# Altium project CryptUS_Daughterboard_Rev1_A.PrjPcb (part 2 of 2)

## Sheet DDR3 Termination.SchDoc
size A4; SheetNumber: 11; SheetTotal: 12
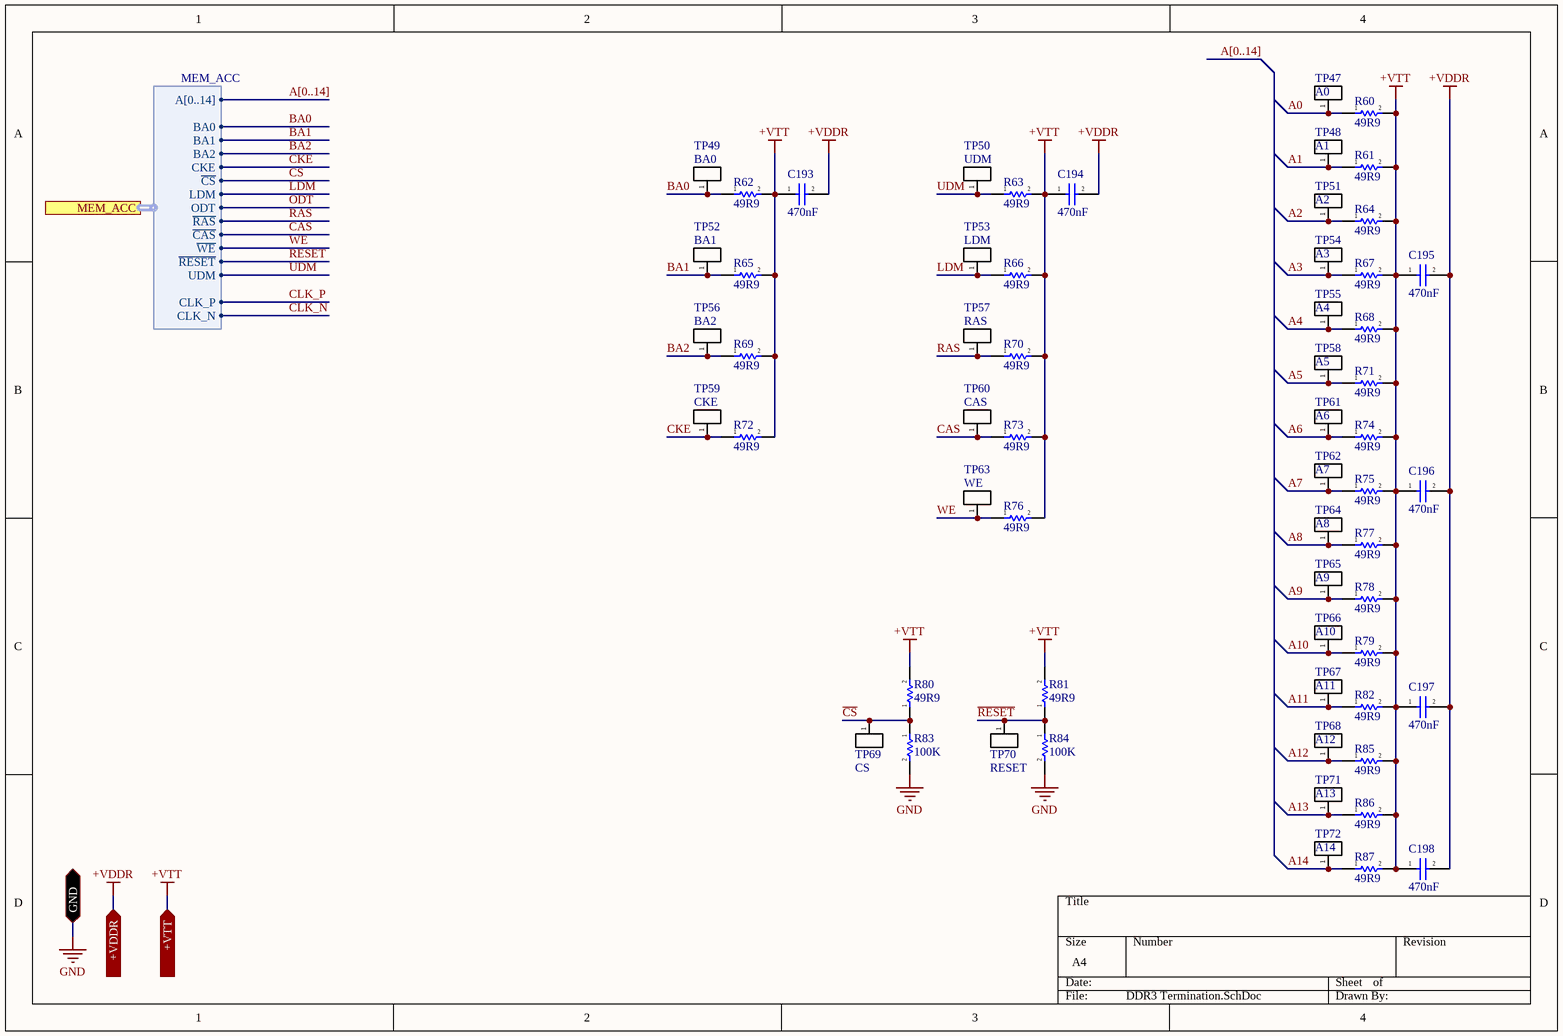
[diagram p10: DDR3 Termination.SchDoc]

### Parts
C193  470nF  [CAP_0402]
C194  470nF  [CAP_0402]
C195  470nF  [CAP_0402]
C196  470nF  [CAP_0402]
C197  470nF  [CAP_0402]
C198  470nF  [CAP_0402]
R60  49R9  [RES_0402]
R61  49R9  [RES_0402]
R62  49R9  [RES_0402]
R63  49R9  [RES_0402]
R64  49R9  [RES_0402]
R65  49R9  [RES_0402]
R66  49R9  [RES_0402]
R67  49R9  [RES_0402]
R68  49R9  [RES_0402]
R69  49R9  [RES_0402]
R70  49R9  [RES_0402]
R71  49R9  [RES_0402]
R72  49R9  [RES_0402]
R73  49R9  [RES_0402]
R74  49R9  [RES_0402]
R75  49R9  [RES_0402]
R76  49R9  [RES_0402]
R77  49R9  [RES_0402]
R78  49R9  [RES_0402]
R79  49R9  [RES_0402]
R80  49R9  [RES_0402]
R81  49R9  [RES_0402]
R82  49R9  [RES_0402]
R83  100K  [RES_0603]
R84  100K  [RES_0603]
R85  49R9  [RES_0402]
R86  49R9  [RES_0402]
R87  49R9  [RES_0402]
TP47  A0  [TP_PAD_TINY]  (no BOM)
TP48  A1  [TP_PAD_TINY]  (no BOM)
TP49  BA0  [TP_PAD_TINY]  (no BOM)
TP50  UDM  [TP_PAD_TINY]  (no BOM)
TP51  A2  [TP_PAD_TINY]  (no BOM)
TP52  BA1  [TP_PAD_TINY]  (no BOM)
TP53  LDM  [TP_PAD_TINY]  (no BOM)
TP54  A3  [TP_PAD_TINY]  (no BOM)
TP55  A4  [TP_PAD_TINY]  (no BOM)
TP56  BA2  [TP_PAD_TINY]  (no BOM)
TP57  RAS  [TP_PAD_TINY]  (no BOM)
TP58  A5  [TP_PAD_TINY]  (no BOM)
TP59  CKE  [TP_PAD_TINY]  (no BOM)
TP60  CAS  [TP_PAD_TINY]  (no BOM)
TP61  A6  [TP_PAD_TINY]  (no BOM)
TP62  A7  [TP_PAD_TINY]  (no BOM)
TP63  WE  [TP_PAD_TINY]  (no BOM)
TP64  A8  [TP_PAD_TINY]  (no BOM)
TP65  A9  [TP_PAD_TINY]  (no BOM)
TP66  A10  [TP_PAD_TINY]  (no BOM)
TP67  A11  [TP_PAD_TINY]  (no BOM)
TP68  A12  [TP_PAD_TINY]  (no BOM)
TP69  CS  [TP_PAD_TINY]  (no BOM)
TP70  RESET  [TP_PAD_TINY]  (no BOM)
TP71  A13  [TP_PAD_TINY]  (no BOM)
TP72  A14  [TP_PAD_TINY]  (no BOM)

### Ports
+VDDR (in), +VTT (in), GND (bidir), MEM_ACC (harness MEM_ACC)

### Harnesses
MEM_ACC: A[0..14], BA0, BA1, BA2, CKE, ~{CS}, LDM, ODT, ~{RAS}, ~{CAS}, ~{WE}, ~{RESET}, UDM, CLK_N, CLK_P

### Nets
+VDDR: C193.2 C194.2 C195.2 C196.2 C197.2 C198.2 ; port +VDDR
+VTT: C193.1 C194.1 C195.1 C196.1 C197.1 C198.1 R60.2 R61.2 R62.2 R63.2 R64.2 R65.2 R66.2 R67.2 R68.2 R69.2 R70.2 R71.2 R72.2 R73.2 R74.2 R75.2 R76.2 R77.2 R78.2 R79.2 R80.2 R81.2 R82.2 R85.2 R86.2 R87.2 ; port +VTT
GND: R83.2 R84.2 ; port GND
~{CS}: R80.1 R83.1 TP69.1(A) ; port MEM_ACC.~{CS}
~{RESET}: R81.1 R84.1 TP70.1(A) ; port MEM_ACC.~{RESET}
A0: R60.1 TP47.1(A)
A1: R61.1 TP48.1(A)
A2: R64.1 TP51.1(A)
A3: R67.1 TP54.1(A)
A4: R68.1 TP55.1(A)
A5: R71.1 TP58.1(A)
A6: R74.1 TP61.1(A)
A7: R75.1 TP62.1(A)
A8: R77.1 TP64.1(A)
A9: R78.1 TP65.1(A)
A10: R79.1 TP66.1(A)
A11: R82.1 TP67.1(A)
A12: R85.1 TP68.1(A)
A13: R86.1 TP71.1(A)
A14: R87.1 TP72.1(A)
BA0: R62.1 TP49.1(A) ; port MEM_ACC.BA0
BA1: R65.1 TP52.1(A) ; port MEM_ACC.BA1
BA2: R69.1 TP56.1(A) ; port MEM_ACC.BA2
CAS: R73.1 TP60.1(A)
CKE: R72.1 TP59.1(A) ; port MEM_ACC.CKE
LDM: R66.1 TP53.1(A) ; port MEM_ACC.LDM
RAS: R70.1 TP57.1(A)
UDM: R63.1 TP50.1(A) ; port MEM_ACC.UDM
WE: R76.1 TP63.1(A)

### Buses and harness runs
bus A[0..14]

### Library data of the parts
C193-C198 = CAP_CER: as CX2 on sheet Title; Operating Temperature: *; Tolerance: *; Mfr: *; ComponentLink1Description: Digikey; ComponentLink1URL: [Digikey Link]; Digikey Part No: *; ComponentLink2Description: Datasheet; ComponentLink2URL: [Datasheet Link]; Footprint: 0402
R60-R82 R85-R87 = RESISTOR: Power: 1/8W; Tolerance: 0.5%; Automotive: *; Operating Temperature: *; Package / Case: 0402; # Digikey: *; ComponentLink1Description: Digikey; ComponentLink1URL: *; # Manufacturer: *
R83 R84 = RESISTOR: Power: 1/16W; Tolerance: 10%; Automotive: *; Operating Temperature: *; # Digikey: *; ComponentLink1Description: Digikey; ComponentLink1URL: *; # Manufacturer: *; Package / Case: 0603
TP47-TP72 = TESTPOINT: Test Point

## Sheet USB.SchDoc
size A3; SheetNumber: 12; SheetTotal: 12
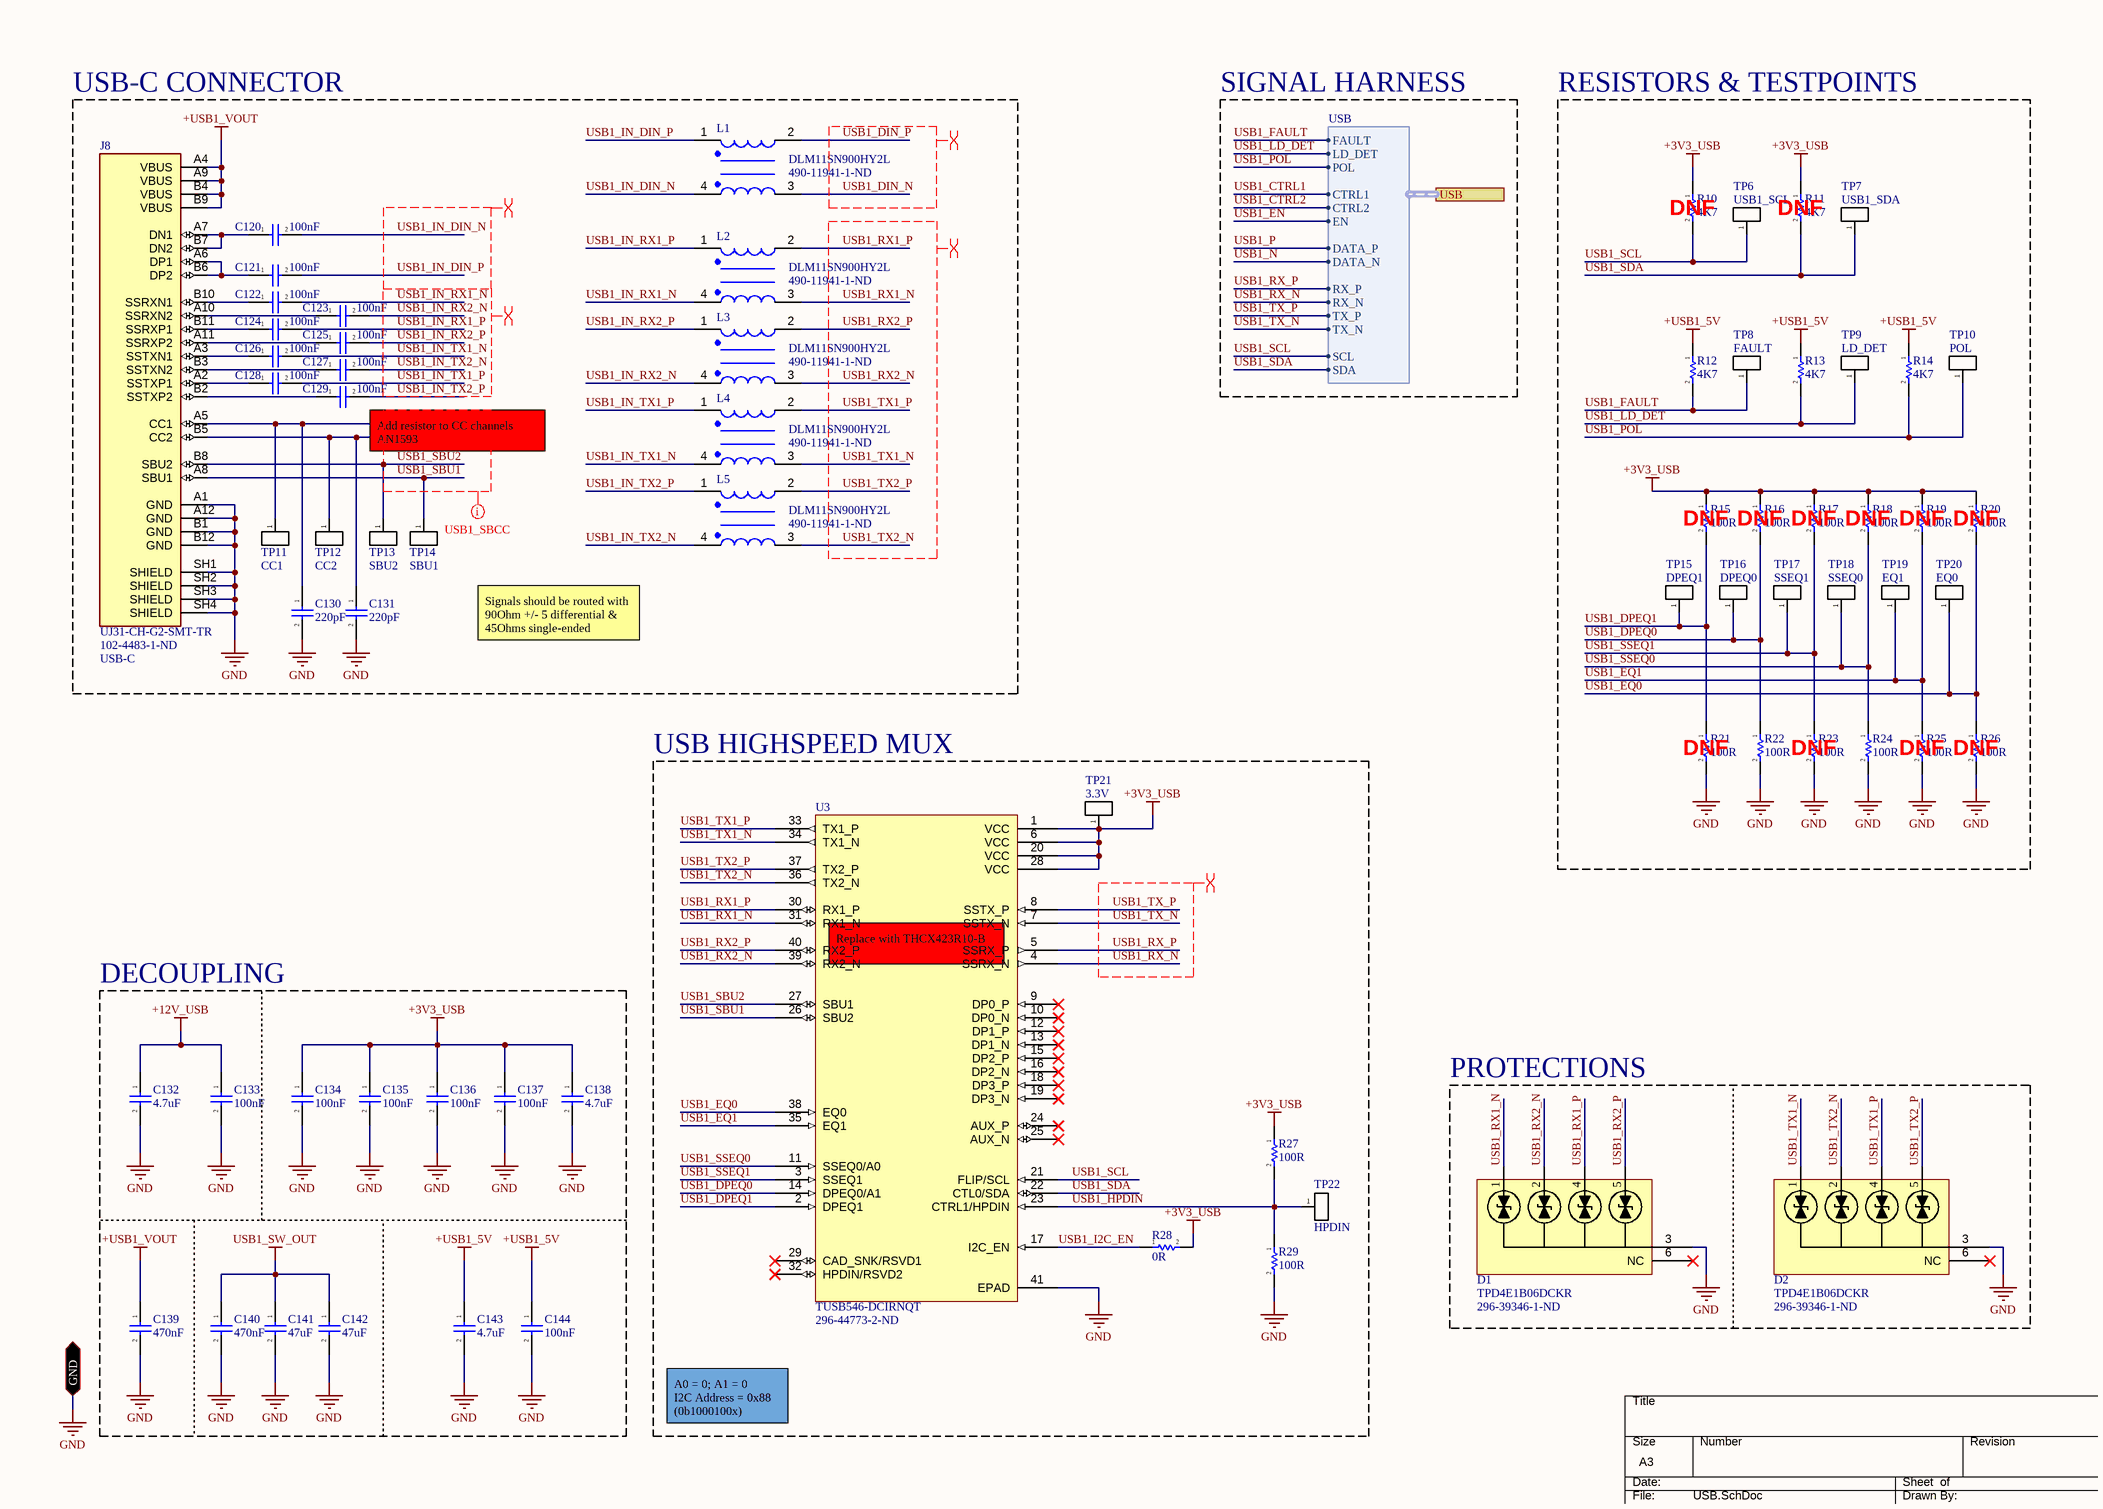
[diagram p11: USB.SchDoc]

### Parts
C120  100nF  [CAP_0402]
C121  100nF  [CAP_0402]
C122  100nF  [CAP_0402]
C123  100nF  [CAP_0402]
C124  100nF  [CAP_0402]
C125  100nF  [CAP_0402]
C126  100nF  [CAP_0402]
C127  100nF  [CAP_0402]
C128  100nF  [CAP_0402]
C129  100nF  [CAP_0402]
C130  220pF  [CAP_0402]
C131  220pF  [CAP_0402]
C132  4.7uF  [CAP_0805]
C133  100nF  [CAP_0402]
C134  100nF  [CAP_0402]
C135  100nF  [CAP_0402]
C136  100nF  [CAP_0402]
C137  100nF  [CAP_0402]
C138  4.7uF  [CAP_0805]
C139  470nF  [CAP_0402]
C140  470nF  [CAP_0402]
C141  47uF  [CAP_1206]
C142  47uF  [CAP_1206]
C143  4.7uF  [CAP_0805]
C144  100nF  [CAP_0402]
D1  TPD4E1B06DCKR  Supplier Part Number 1: 296-39346-1-ND  [TPD4E1B06DCKR]
D2  TPD4E1B06DCKR  Supplier Part Number 1: 296-39346-1-ND  [TPD4E1B06DCKR]
J8  UJ31-CH-G2-SMT-TR  Connector Type: USB-C  Supplier Part Number 1: 102-4483-1-ND  [UJ31-CH-G2-SMT-TR]
L1  DLM11SN900HY2L  Supplier Part Number 1: 490-11941-1-ND  [DLM11SN900HY2L]
L2  DLM11SN900HY2L  Supplier Part Number 1: 490-11941-1-ND  [DLM11SN900HY2L]
L3  DLM11SN900HY2L  Supplier Part Number 1: 490-11941-1-ND  [DLM11SN900HY2L]
L4  DLM11SN900HY2L  Supplier Part Number 1: 490-11941-1-ND  [DLM11SN900HY2L]
L5  DLM11SN900HY2L  Supplier Part Number 1: 490-11941-1-ND  [DLM11SN900HY2L]
R10  4K7  [RES_0603]
R11  4K7  [RES_0603]
R12  4K7  [RES_0603]
R13  4K7  [RES_0603]
R14  4K7  [RES_0603]
R15  100R  [RES_0402]
R16  100R  [RES_0402]
R17  100R  [RES_0402]
R18  100R  [RES_0402]
R19  100R  [RES_0402]
R20  100R  [RES_0402]
R21  100R  [RES_0402]
R22  100R  [RES_0402]
R23  100R  [RES_0402]
R24  100R  [RES_0402]
R25  100R  [RES_0402]
R26  100R  [RES_0402]
R27  100R  [RES_0402]
R28  0R  [RES_0603]
R29  100R  [RES_0402]
TP6  USB1_SCL  [TP_PAD_SMALL]  (no BOM)
TP7  USB1_SDA  [TP_PAD_SMALL]  (no BOM)
TP8  FAULT  [TP_PAD_TINY]  (no BOM)
TP9  LD_DET  [TP_PAD_TINY]  (no BOM)
TP10  POL  [TP_PAD_TINY]  (no BOM)
TP11  CC1  [TP_PAD_TINY]  (no BOM)
TP12  CC2  [TP_PAD_TINY]  (no BOM)
TP13  SBU2  [TP_PAD_TINY]  (no BOM)
TP14  SBU1  [TP_PAD_TINY]  (no BOM)
TP15  DPEQ1  [TP_PAD_TINY]  (no BOM)
TP16  DPEQ0  [TP_PAD_TINY]  (no BOM)
TP17  SSEQ1  [TP_PAD_TINY]  (no BOM)
TP18  SSEQ0  [TP_PAD_TINY]  (no BOM)
TP19  EQ1  [TP_PAD_TINY]  (no BOM)
TP20  EQ0  [TP_PAD_TINY]  (no BOM)
TP21  3.3V  [TP_PAD]  (no BOM)
TP22  HPDIN  [TP_PAD_TINY]  (no BOM)
U3  TUSB546-DCIRNQT  Supplier Part Number 1: 296-44773-2-ND  [TUSB546-DCIRNQT]

### Blocks framed on the sheet
USB-C CONNECTOR: C120-C131 J8 L1-L5 TP11-TP14
RESISTORS & TESTPOINTS: R10-R26 TP6-TP10 TP15-TP20
USB HIGHSPEED MUX: R27-R29 TP21 TP22 U3
DECOUPLING: C132-C144
PROTECTIONS: D1 D2

### Ports
GND (bidir), USB (harness USB)

### Harnesses
USB: FAULT, LD_DET, POL, CTRL1, CTRL2, EN, DATA_P, DATA_N, RX_P, RX_N, TX_P, TX_N, SCL, SDA

### Nets
+3V3_USB: C134.1 C135.1 C136.1 C137.1 C138.1 R10.1 R11.1 R15.1 R16.1 R17.1 R18.1 R19.1 R20.1 R27.1 R28.2 TP21.1(A) U3.1(VCC) U3.6(VCC) U3.20(VCC) U3.28(VCC)
+12V_USB: C132.1 C133.1
+USB1_5V: C143.1 C144.1 R12.1 R13.1 R14.1
+USB1_VOUT: C139.1 J8.A4(VBUS) J8.A9(VBUS) J8.B4(VBUS) J8.B9(VBUS)
GND: C130.2 C131.2 C132.2 C133.2 C134.2 C135.2 C136.2 C137.2 C138.2 C139.2 C140.2 C141.2 C142.2 C143.2 C144.2 D1.3(GND) D2.3(GND) J8.A1(GND) J8.A12(GND) J8.B1(GND) J8.B12(GND) J8.SH1(SHIELD) J8.SH2(SHIELD) J8.SH3(SHIELD) J8.SH4(SHIELD) R21.2 R22.2 R23.2 R24.2 R25.2 R26.2 R29.2 U3.41(EPAD) ; port GND
USB1_SW_OUT: C140.1 C141.1 C142.1
USB1_CC1: C130.1 J8.A5(CC1) TP11.1(A)
USB1_CC2: C131.1 J8.B5(CC2) TP12.1(A)
USB1_CTRL1: port USB.CTRL1
USB1_CTRL2: port USB.CTRL2
USB1_DIN_N: L1.3
USB1_DIN_P: L1.2
USB1_DPEQ0: R16.2 R22.1 TP16.1(A) U3.14(DPEQ0/A1)
USB1_DPEQ1: R15.2 R21.1 TP15.1(A) U3.2(DPEQ1)
USB1_EN: port USB.EN
USB1_EQ0: R20.2 R26.1 TP20.1(A) U3.38(EQ0)
USB1_EQ1: R19.2 R25.1 TP19.1(A) U3.35(EQ1)
USB1_FAULT: R12.2 TP8.1(A) ; port USB.FAULT
USB1_HPDIN: R27.2 R29.1 TP22.1(A) U3.23(CTRL1/HPDIN)
USB1_I2C_EN: R28.1 U3.17(I2C_EN)
USB1_IN_DIN_N: C120.2 L1.4
USB1_IN_DIN_P: C121.2 L1.1
USB1_IN_RX1_N: C122.2 L2.4
USB1_IN_RX1_P: C124.2 L2.1
USB1_IN_RX2_N: C123.2 L3.4
USB1_IN_RX2_P: C125.2 L3.1
USB1_IN_TX1_N: C126.2 L4.4
USB1_IN_TX1_P: C128.2 L4.1
USB1_IN_TX2_N: C127.2 L5.4
USB1_IN_TX2_P: C129.2 L5.1
USB1_LD_DET: R13.2 TP9.1(A) ; port USB.LD_DET
USB1_N: port USB.DATA_N
USB1_P: port USB.DATA_P
USB1_POL: R14.2 TP10.1(A) ; port USB.POL
USB1_RX1_N: D1.1(A) L2.3 U3.31(RX1_N)
USB1_RX1_P: D1.4(A) L2.2 U3.30(RX1_P)
USB1_RX2_N: D1.2(A) L3.3 U3.39(RX2_N)
USB1_RX2_P: D1.5(A) L3.2 U3.40(RX2_P)
USB1_RX_N: U3.4(SSRX_N) ; port USB.RX_N
USB1_RX_P: U3.5(SSRX_P) ; port USB.RX_P
USB1_SBU1: J8.A8(SBU1) TP14.1(A) U3.26(SBU2)
USB1_SBU2: J8.B8(SBU2) TP13.1(A) U3.27(SBU1)
USB1_SCL: R10.2 TP6.1(A) U3.21(FLIP/SCL) ; port USB.SCL
USB1_SDA: R11.2 TP7.1(A) U3.22(CTL0/SDA) ; port USB.SDA
USB1_SSEQ0: R18.2 R24.1 TP18.1(A) U3.11(SSEQ0/A0)
USB1_SSEQ1: R17.2 R23.1 TP17.1(A) U3.3(SSEQ1)
USB1_TX1_N: D2.1(A) L4.3 U3.34(TX1_N)
USB1_TX1_P: D2.4(A) L4.2 U3.33(TX1_P)
USB1_TX2_N: D2.2(A) L5.3 U3.36(TX2_N)
USB1_TX2_P: D2.5(A) L5.2 U3.37(TX2_P)
USB1_TX_N: U3.7(SSTX_N) ; port USB.TX_N
USB1_TX_P: U3.8(SSTX_P) ; port USB.TX_P
NetC120_1: C120.1 J8.A7(DN1) J8.B7(DN2)
NetC121_1: C121.1 J8.A6(DP1) J8.B6(DP2)
NetC122_1: C122.1 J8.B10(SSRXN1)
NetC123_1: C123.1 J8.A10(SSRXN2)
NetC124_1: C124.1 J8.B11(SSRXP1)
NetC125_1: C125.1 J8.A11(SSRXP2)
NetC126_1: C126.1 J8.A3(SSTXN1)
NetC127_1: C127.1 J8.B3(SSTXN2)
NetC128_1: C128.1 J8.A2(SSTXP1)
NetC129_1: C129.1 J8.B2(SSTXP2)

Not connected (* = marked no-connect by the designer): D1 6(NC)*; D2 6(NC)*; U3 9(DP0_P)* 10(DP0_N)* 12(DP1_P)* 13(DP1_N)* 15(DP2_P)* 16(DP2_N)* 18(DP3_P)* 19(DP3_N)* 24(AUX_P)* 25(AUX_N)* 29(CAD_SNK/RSVD1)* 32(HPDIN/RSVD2)*

### Layout directives
differential pair; net class USB: USB1_DIN_N, USB1_DIN_P, USB1_IN_DIN_N, USB1_IN_DIN_P, USB1_RX_N, USB1_RX_P, USB1_TX_N, USB1_TX_P
differential pair; net class USB; net class USB_SS: USB1_IN_RX1_N, USB1_IN_RX1_P, USB1_IN_RX2_N, USB1_IN_RX2_P, USB1_IN_TX1_N, USB1_IN_TX1_P, USB1_IN_TX2_N, USB1_IN_TX2_P, USB1_RX1_N, USB1_RX1_P, USB1_RX2_N, USB1_RX2_P, USB1_TX1_N, USB1_TX1_P, USB1_TX2_N, USB1_TX2_P
net class USB: USB1_CC1, USB1_CC2, USB1_SBU1, USB1_SBU2

### Notes on the sheet
- SIGNAL HARNESS
- (near C129) Add resistor to CC channels
  AN1593
- Signals should be routed with 90Ohm +/- 5 differential & 45Ohms single-ended
- (near U3) Replace with THCX423R10-B
- A0 = 0; A1 = 0
  I2C Address = 0x88
  (0b1000100x)
- DWG NO:
- REV:
- THIS DOCUMENT AND THE DATA DISCLOSED HEREIN OR
- HEREWITH IS THE PROPERTY OF ALTIUM LIMITED AND MAY
- BE FREELY DISTRIBUTED IN WHOLE. NO RIGHTS ARE
- RESERVED OR EXPRESS OR IMPLIED WARANTEE GIVEN.
- REVISION
- DESCRIPTION
- DATE
- APPROVED
- ENG:
- APPROVALS
- PROJECT
- DSN:
- CHK:
- REFERENCE DOCUMENTS
- PROJECT REVISION:
- TITLE
- DOCUMENT REVISION:
- DESIGN ITEM:
- BOM:
- FAB DWG:
- PCB DWG:
- ASSY DWG:
- SCALE:
- FILE NAME
- A2
- SIZE
- CAGE CODE
- DWG NO.
- SHEET
- OF
- REV

### Library data of the parts
C120-C144 = CAP_CER: Generic SMT Ceramic Capacitor; Voltage - Rated: 25V; Operating Temperature: *; Tolerance: *; Mfr: *; ComponentLink1Description: Digikey; ComponentLink1URL: [Digikey Link]; Digikey Part No: *; ComponentLink2Description: Datasheet; ComponentLink2URL: [Datasheet Link]
  C120-C131 C133-C137 C139 C140 C144: Footprint: 0402
  C132 C138 C143: Footprint: 0805
  C141 C142: Footprint: 1206
D1 D2 = DIODE_TPD4E1B06DCKR: TVS DIODE 5.5VWM 14.5VC SC70-6; Mfr: Texas Instruments; Voltage - Reverse: 5.5V; Breakdown Voltage: 7V; Clamping Voltage: 14.5V; Current Peak (10/1ms): 3A; Power Peak: 45W; Operating Temperature: -40C - 125C; Supplier 1: Digi-Key
J8 = CONN_UJ31-CH-G2-SMT-TR: Type C, USB 3.1 Gen 2, 5 A, Right Angle, Surface Mount _SMT_, USB Receptacle; Mfr: CUI Devices; Number of Contacts: 24; Specifications: USB 3.2 Gen 2 (USB 3.1 Gen 2, Superspeed + (USB 3.1)); Current Rating: 6.25A; Voltage Rating: 20V; Operating Temperature: -25C - 80C; Digikey Part Number: 102-4483-1-ND; ComponentLink1Description: Digikey; ComponentLink1URL: https://www.digikey.ca/en/products/detail/cui-devices/UJ31-CH-G2-SMT-TR/8024057; Supplier 1: Digi-Key
L1-L5 = IND_DLM11SN900HY2L: 2 Line Common Mode Choke Surface Mount 90 Ohms @ 100MHz 100mA DCR 1.38Ohm; Voltage Rating: 5V; Impedance: 90 Ohms @ 100MHz; Current Rating: 100mA; DC resistance: 1.38Ohm; Operating Temperature: -40C - 85C; Package: 0504; Supplier 1: Digi-Key
R10-R14 = RESISTOR: Power: 1/16W; Tolerance: 10%; Automotive: *; Operating Temperature: *; # Digikey: *; ComponentLink1Description: Digikey; ComponentLink1URL: *; # Manufacturer: *; Package / Case: 0603
R15-R29 = RESISTOR: Power: 1/8W; Tolerance: 10%; Automotive: *; Operating Temperature: *; # Digikey: *; ComponentLink1Description: Digikey; ComponentLink1URL: *; # Manufacturer: *
  R15-R27 R29: Package / Case: 0402
  R28: Package / Case: 0603
TP6-TP22 = TESTPOINT: Test Point
U3 = IC_TUSB546-DCIRNQT: Buffer, ReDriver 2 Channel 8.1Gbps 40-WQFN (4x6); Mfr: Texas Instruments; Supply Voltage: 3.3V - 3.6V; Operating Temperature: 0C - 70C; Supplier 1: Digi-Key

## Sheet FPGA Regulators.SchDoc
size A3; SheetNumber: 7; SheetTotal: 12
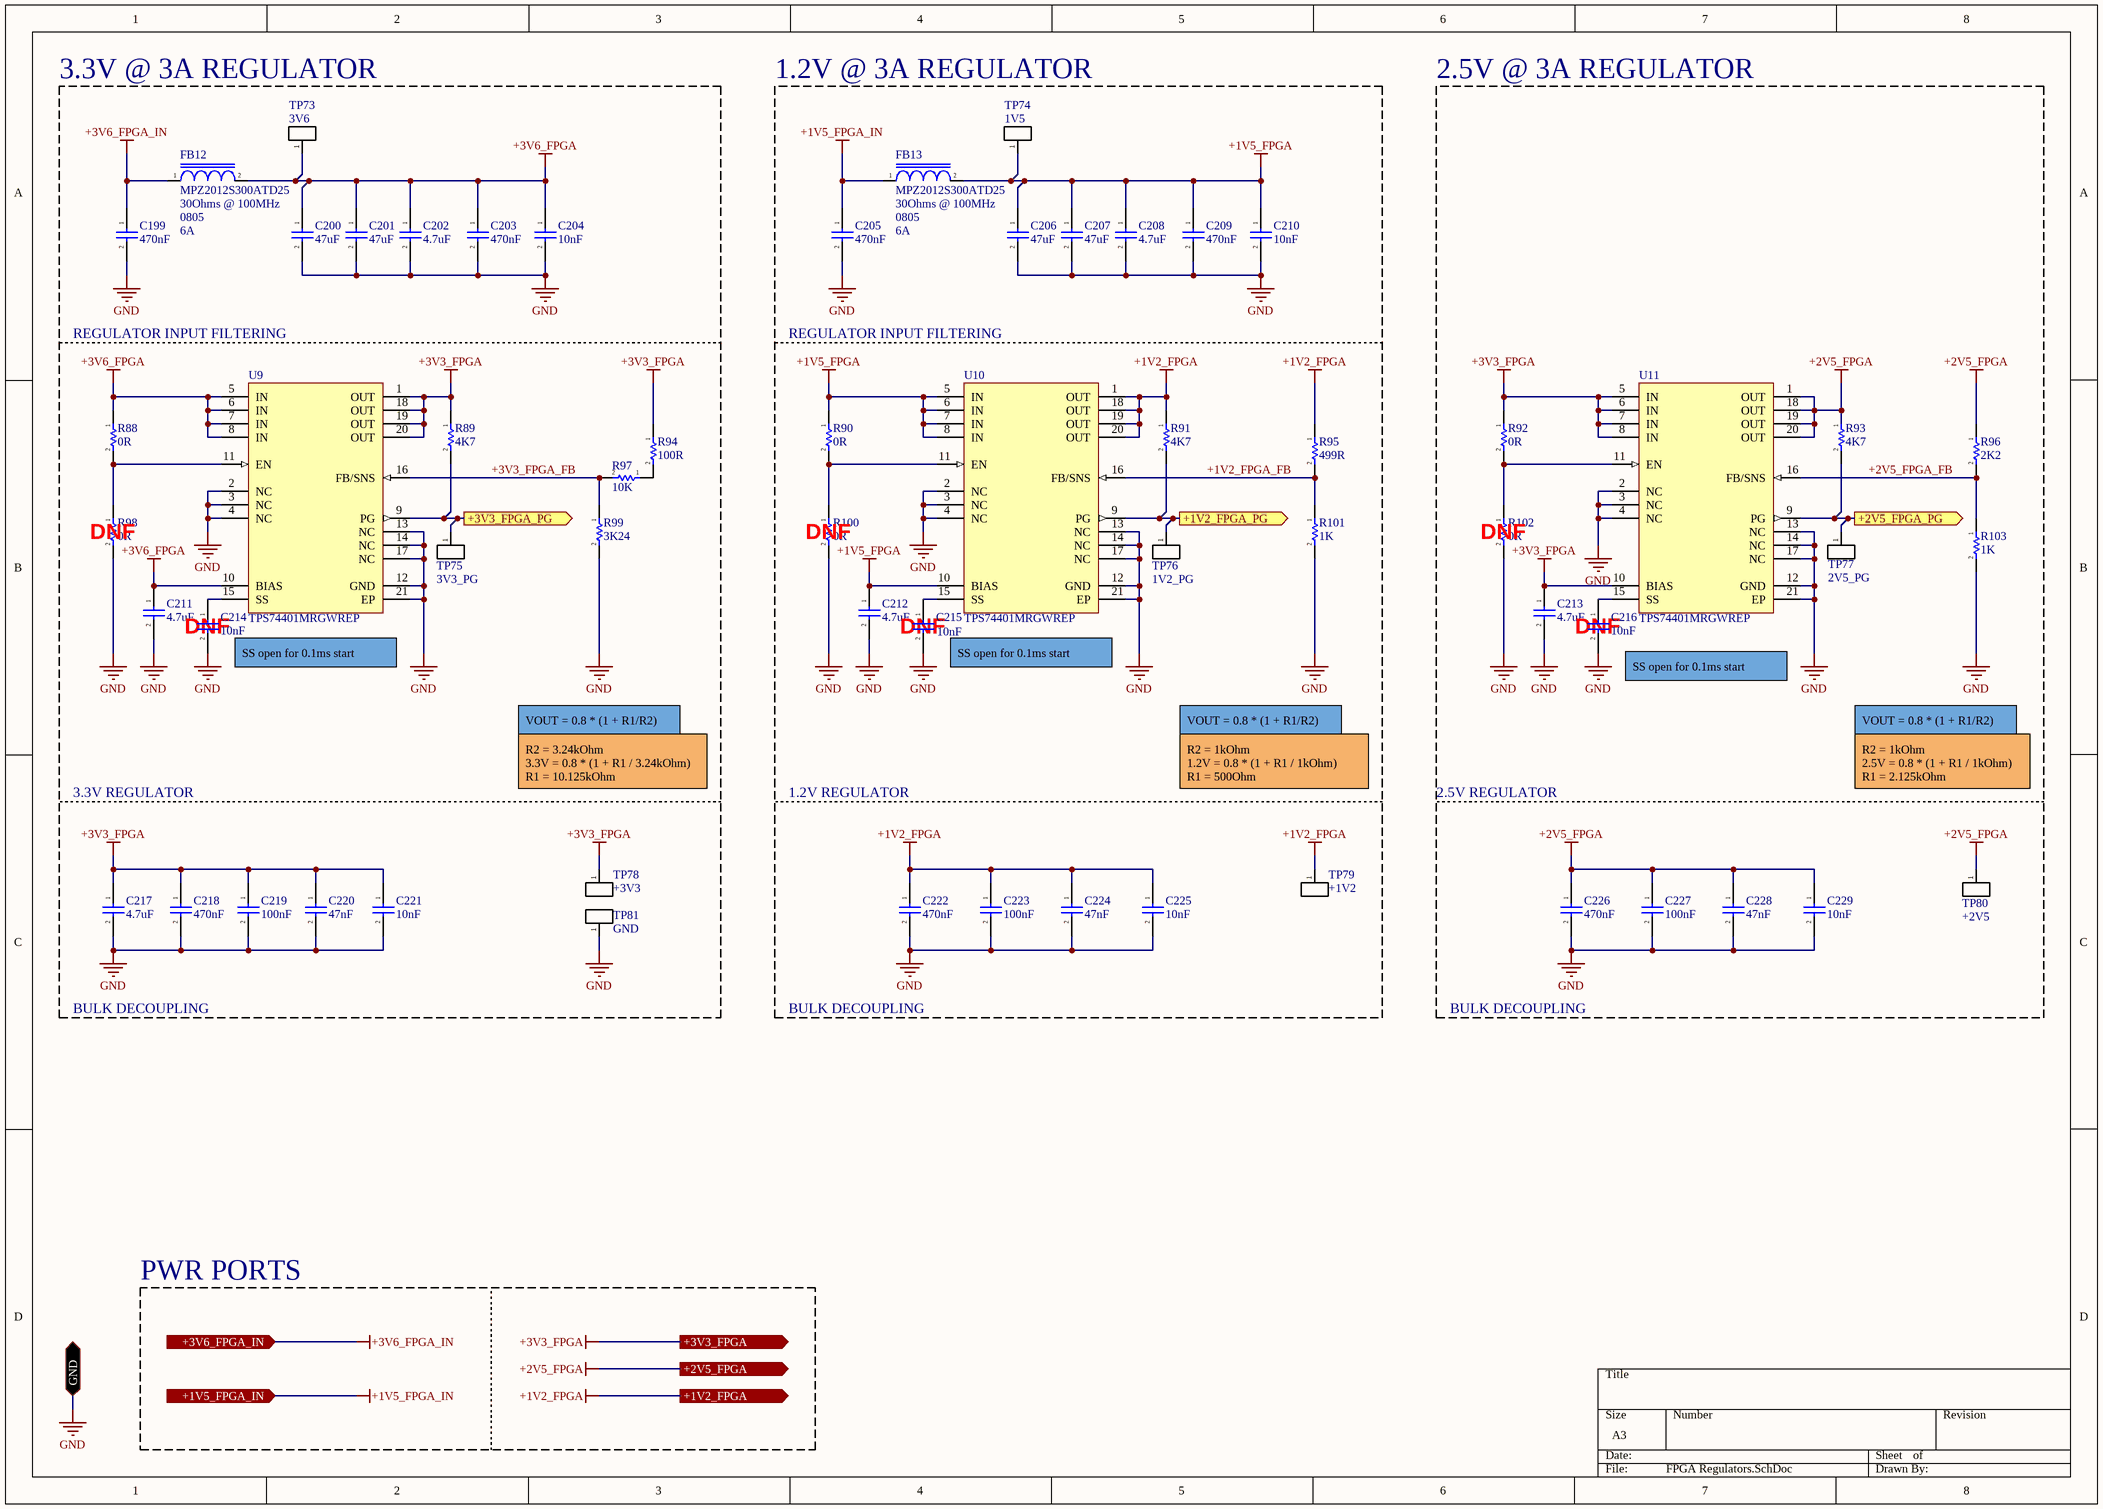
[diagram p12: FPGA Regulators.SchDoc]

### Parts
C199  470nF  [CAP_0402]
C200  47uF  [CAP_1206]
C201  47uF  [CAP_1206]
C202  4.7uF  [CAP_0805]
C203  470nF  [CAP_0402]
C204  10nF  [CAP_0201]
C205  470nF  [CAP_0402]
C206  47uF  [CAP_1206]
C207  47uF  [CAP_1206]
C208  4.7uF  [CAP_0805]
C209  470nF  [CAP_0402]
C210  10nF  [CAP_0201]
C211  4.7uF  [CAP_0805]
C212  4.7uF  [CAP_0805]
C213  4.7uF  [CAP_0805]
C214  10nF  [CAP_0201]
C215  10nF  [CAP_0201]
C216  10nF  [CAP_0201]
C217  4.7uF  [CAP_0805]
C218  470nF  [CAP_0402]
C219  100nF  [CAP_0402]
C220  47nF  [CAP_0201]
C221  10nF  [CAP_0201]
C222  470nF  [CAP_0402]
C223  100nF  [CAP_0402]
C224  47nF  [CAP_0201]
C225  10nF  [CAP_0201]
C226  470nF  [CAP_0402]
C227  100nF  [CAP_0402]
C228  47nF  [CAP_0201]
C229  10nF  [CAP_0201]
FB12  MPZ2012S300ATD25  Impedance @ Freq: 30Ohms @ 100MHz  Package / Case: 0805  Current Rating: 6A  [IND_0805]
FB13  MPZ2012S300ATD25  Impedance @ Freq: 30Ohms @ 100MHz  Package / Case: 0805  Current Rating: 6A  [IND_0805]
R88  0R  [RES_0603]
R89  4K7  [RES_0603]
R90  0R  [RES_0603]
R91  4K7  [RES_0603]
R92  0R  [RES_0603]
R93  4K7  [RES_0603]
R94  100R  [RES_0402]
R95  499R  [RES_0402]
R96  2K2  [RES_0603]
R97  10K  [RES_0603]
R98  0R  [RES_0603]
R99  3K24  [RES_0603]
R100  0R  [RES_0603]
R101  1K  [RES_0603]
R102  0R  [RES_0603]
R103  1K  [RES_0603]
TP73  3V6  [TP_PAD]  (no BOM)
TP74  1V5  [TP_PAD]  (no BOM)
TP75  3V3_PG  [TP_PAD_TINY]  (no BOM)
TP76  1V2_PG  [TP_PAD_TINY]  (no BOM)
TP77  2V5_PG  [TP_PAD_TINY]  (no BOM)
TP78  +3V3  [TP_HOLE]  (no BOM)
TP79  +1V2  [TP_HOLE]  (no BOM)
TP80  +2V5  [TP_HOLE]  (no BOM)
TP81  GND  [TP_PAD_SMALL]  (no BOM)
U9  TPS74401MRGWREP  [TPS74401]
U10  TPS74401MRGWREP  [TPS74401]
U11  TPS74401MRGWREP  [TPS74401]

### Blocks framed on the sheet
3.3V @ 3A REGULATOR: C199-C204 C211 C214 C217-C221 FB12 R88 R89 R94 R97-R99 TP73 TP75 TP78 TP81 U9
1.2V @ 3A REGULATOR: C205-C210 C212 C215 C222-C225 FB13 R90 R91 R95 R100 R101 TP74 TP76 TP79 U10
2.5V @ 3A REGULATOR: C213 C216 C226-C229 R92 R93 R96 R102 R103 TP77 TP80 U11

### Ports
+1V2_FPGA (out), +1V2_FPGA_PG (out), +1V5_FPGA_IN (in), +2V5_FPGA (out), +2V5_FPGA_PG (out), +3V3_FPGA (out), +3V3_FPGA_PG (out), +3V6_FPGA_IN (in), GND (bidir)

### Nets
+1V2_FPGA: C222.1 C223.1 C224.1 C225.1 R91.1 R95.1 TP79.1(A) U10.1(OUT) U10.18(OUT) U10.19(OUT) U10.20(OUT) ; port +1V2_FPGA
+1V5_FPGA: C206.1 C207.1 C208.1 C209.1 C210.1 C212.1 FB13.2 R90.1 TP74.1(A) U10.5(IN) U10.6(IN) U10.7(IN) U10.8(IN) U10.10(BIAS)
+1V5_FPGA_IN: C205.1 FB13.1 ; port +1V5_FPGA_IN
+2V5_FPGA: C226.1 C227.1 C228.1 C229.1 R93.1 R96.1 TP80.1(A) U11.1(OUT) U11.18(OUT) U11.19(OUT) U11.20(OUT) ; port +2V5_FPGA
+3V3_FPGA: C213.1 C217.1 C218.1 C219.1 C220.1 C221.1 R89.1 R92.1 R94.1 TP78.1(A) U9.1(OUT) U9.18(OUT) U9.19(OUT) U9.20(OUT) U11.5(IN) U11.6(IN) U11.7(IN) U11.8(IN) U11.10(BIAS) ; port +3V3_FPGA
+3V6_FPGA: C200.1 C201.1 C202.1 C203.1 C204.1 C211.1 FB12.2 R88.1 TP73.1(A) U9.5(IN) U9.6(IN) U9.7(IN) U9.8(IN) U9.10(BIAS)
+3V6_FPGA_IN: C199.1 FB12.1 ; port +3V6_FPGA_IN
GND: C199.2 C200.2 C201.2 C202.2 C203.2 C204.2 C205.2 C206.2 C207.2 C208.2 C209.2 C210.2 C211.2 C212.2 C213.2 C214.2 C215.2 C216.2 C217.2 C218.2 C219.2 C220.2 C221.2 C222.2 C223.2 C224.2 C225.2 C226.2 C227.2 C228.2 C229.2 R98.2 R99.2 R100.2 R101.2 R102.2 R103.2 TP81.1(A) U9.2(NC) U9.3(NC) U9.4(NC) U9.12(GND) U9.13(NC) U9.14(NC) U9.17(NC) U9.21(EP) U10.2(NC) U10.3(NC) U10.4(NC) U10.12(GND) U10.13(NC) U10.14(NC) U10.17(NC) U10.21(EP) U11.2(NC) U11.3(NC) U11.4(NC) U11.12(GND) U11.13(NC) U11.14(NC) U11.17(NC) U11.21(EP) ; port GND
+1V2_FPGA_FB: R95.2 R101.1 U10.16(FB/SNS)
+2V5_FPGA_FB: R96.2 R103.1 U11.16(FB/SNS)
+3V3_FPGA_FB: R97.2 R99.1 U9.16(FB/SNS)
NetC214_1: C214.1 U9.15(SS)
NetC215_1: C215.1 U10.15(SS)
NetC216_1: C216.1 U11.15(SS)
NetR88_2: R88.2 R98.1 U9.11(EN)
NetR89_2: R89.2 TP75.1(A) U9.9(PG) ; port +3V3_FPGA_PG
NetR90_2: R90.2 R100.1 U10.11(EN)
NetR91_2: R91.2 TP76.1(A) U10.9(PG) ; port +1V2_FPGA_PG
NetR92_2: R92.2 R102.1 U11.11(EN)
NetR93_2: R93.2 TP77.1(A) U11.9(PG) ; port +2V5_FPGA_PG
NetR94_2: R94.2 R97.1

### Notes on the sheet
- REGULATOR INPUT FILTERING
- SS open for 0.1ms start
- (near C216) SS open for 0.1ms start
- VOUT = 0.8 * (1 + R1/R2)
- R2 = 3.24kOhm
  3.3V = 0.8 * (1 + R1 / 3.24kOhm)
  R1 = 10.125kOhm
- R2 = 1kOhm
  1.2V = 0.8 * (1 + R1 / 1kOhm)
  R1 = 500Ohm
- R2 = 1kOhm
  2.5V = 0.8 * (1 + R1 / 1kOhm)
  R1 = 2.125kOhm
- 3.3V REGULATOR
- 1.2V REGULATOR
- 2.5V REGULATOR
- BULK DECOUPLING
- PWR PORTS

### Library data of the parts
C199-C229 = CAP_CER: as C120-C144 on sheet USB; Operating Temperature: *; Tolerance: *; Mfr: *; ComponentLink1Description: Digikey; ComponentLink1URL: [Digikey Link]; Digikey Part No: *; ComponentLink2Description: Datasheet; ComponentLink2URL: [Datasheet Link]
  C199 C203 C205 C209 C218 C219 C222 C223 C226 C227: Footprint: 0402
  C200 C201 C206 C207: Footprint: 1206
  C202 C208 C211-C213 C217: Footprint: 0805
  C204 C210 C214-C216 C220 C221 C224 C225 C228 C229: Footprint: 0201
FB12 FB13 = IND_MPZ2012S300ATD25: 30 Ohms @ 100 MHz 1 Power Line Ferrite Bead 0805 (2012 Metric) 6A 10mOhm; Resistance: 10mOhms; Operating Temperature: -55C - 125C; Rating: AEC-Q200
R88 R90 R92 R94 R98 R100 R102 = RESISTOR: Power: 1/8W; Tolerance: 10%; Automotive: *; Operating Temperature: *; # Digikey: *; ComponentLink1Description: Digikey; ComponentLink1URL: *; # Manufacturer: *
  R88 R90 R92 R98 R100 R102: Package / Case: 0603
  R94: Package / Case: 0402
R89 R91 R93 R97 = RESISTOR: Power: 1/16W; Tolerance: 10%; Automotive: *; Operating Temperature: *; # Digikey: *; ComponentLink1Description: Digikey; ComponentLink1URL: *; # Manufacturer: *; Package / Case: 0603
R95 = RESISTOR: Power: 1/8W; Tolerance: 1%; Automotive: *; Operating Temperature: *; # Digikey: *; ComponentLink1Description: Digikey; ComponentLink1URL: *; # Manufacturer: *; Package / Case: 0402
R96 R99 = RESISTOR: Power: 1/16W; Tolerance: 2%; Automotive: *; Operating Temperature: *; # Digikey: *; ComponentLink1Description: Digikey; ComponentLink1URL: *; # Manufacturer: *; Package / Case: 0603
R101 R103 = RESISTOR: Power: 1/8W; Tolerance: 5%; Automotive: *; Operating Temperature: *; # Digikey: *; ComponentLink1Description: Digikey; ComponentLink1URL: *; # Manufacturer: *; Package / Case: 0603
TP73-TP81 = TESTPOINT: Test Point
U9-U11 = IC_TPS47701: IC REG LINEAR POS ADJ 3A 20VQFN; Mfr: Texas Instruments; Input Voltage (min): 240mV; Input Voltage (max): 5.5V; Output Voltage (min): 0.8V; Output Voltage (max): 3.6V; PSRR: 73dB - 50dB; Current: 3A; Operating Temperature: -55C - 125C; Package / Case: 20-VQFN; Digikey Part Number: 296-27227-1-ND; Voltage Dropout (max): 240mV; ComponentLink1Description: Digikey; ComponentLink1URL: https://www.digikey.ca/en/products/detail/texas-instruments/TPS74401MRGWREP/2261531; ComponentLink2Description: Datasheet; ComponentLink2URL: https://www.ti.com/lit/ds/symlink/tps74401-ep.pdf

## Nets that join several sheets
+1V2_FPGA: FPGA Power (18 pins), FPGA Regulators (11 pins)
+1V5_FPGA_IN: Mechanical and Interconnect (J5.2 J5.3), FPGA Regulators (C205.1 FB13.1)
+2V3_DDR_IN: Mechanical and Interconnect (J6.2 J6.3), DDR3 Regulators (C165.1 FB10.1)
+2V5_FPGA: FPGA Power (6 pins), FPGA Regulators (11 pins)
+3V3_FPGA: FPGA PERIPHERALS (30 pins), FPGA Power (U1.P9 U1.P10), Mechanical and Interconnect (J4.1), FPGA Regulators (19 pins)
+3V6_FPGA_IN: Mechanical and Interconnect (J1.2 J1.3), FPGA Regulators (C199.1 FB12.1)
+VDDR: DDR3 Power (76 pins), DDR3 (C117.1), DDR3 Termination (6 pins)
+VREF: DDR3 Regulators (8 pins), DDR3 Power (U2.H1 U2.M8)
+VTT: DDR3 Regulators (9 pins), DDR3 Termination (32 pins)
GND: FPGA PERIPHERALS (40 pins), FPGA Power (142 pins), Mechanical and Interconnect (29 pins), DDR3 Regulators (40 pins), DDR3 Power (80 pins), DDR3 Termination (R83.2 R84.2), USB (33 pins), FPGA Regulators (62 pins)
~{CS}: DDR3 (U2.L2), DDR3 Termination (R80.1 R83.1 TP69.1)
~{RESET}: DDR3 (U2.T2), DDR3 Termination (R81.1 R84.1 TP70.1)
A0: DDR3 (U2.N3), DDR3 Termination (R60.1 TP47.1)
A1: DDR3 (U2.P7), DDR3 Termination (R61.1 TP48.1)
A2: DDR3 (U2.P3), DDR3 Termination (R64.1 TP51.1)
A3: DDR3 (U2.N2), DDR3 Termination (R67.1 TP54.1)
A4: DDR3 (U2.P8), DDR3 Termination (R68.1 TP55.1)
A5: DDR3 (U2.P2), DDR3 Termination (R71.1 TP58.1)
A6: DDR3 (U2.R8), DDR3 Termination (R74.1 TP61.1)
A7: DDR3 (U2.R2), DDR3 Termination (R75.1 TP62.1)
A8: DDR3 (U2.T8), DDR3 Termination (R77.1 TP64.1)
A9: DDR3 (U2.R3), DDR3 Termination (R78.1 TP65.1)
A10: DDR3 (U2.L7), DDR3 Termination (R79.1 TP66.1)
A11: DDR3 (U2.R7), DDR3 Termination (R82.1 TP67.1)
A12: DDR3 (U2.N7), DDR3 Termination (R85.1 TP68.1)
A13: DDR3 (U2.T3), DDR3 Termination (R86.1 TP71.1)
A14: DDR3 (U2.T7), DDR3 Termination (R87.1 TP72.1)
BA0: DDR3 (U2.M2), DDR3 Termination (R62.1 TP49.1)
BA1: DDR3 (U2.N8), DDR3 Termination (R65.1 TP52.1)
BA2: DDR3 (U2.M3), DDR3 Termination (R69.1 TP56.1)
CKE: DDR3 (U2.K9), DDR3 Termination (R72.1 TP59.1)
DONE: FPGA PERIPHERALS (5 pins), Mechanical and Interconnect (J4.9)
FLASH_CS: FPGA IO (R3.1), FPGA PERIPHERALS (C151.1 TP36.1 U5.1)
FLASH_MISO: FPGA IO (R1.1), FPGA PERIPHERALS (TP33.1 U5.2)
FLASH_MOSI: FPGA IO (R2.1), FPGA PERIPHERALS (TP34.1 U5.5)
HEARTBEAT: FPGA IO (U1.F1), FPGA PERIPHERALS (D7.2 U4.1)
INITN: FPGA PERIPHERALS (C146.1 R31.2 TP24.1 U1.V3), Mechanical and Interconnect (J4.10)
LDM: DDR3 (U2.E7), DDR3 Termination (R66.1 TP53.1)
NetD9_2: FPGA IO (U1.H1), FPGA PERIPHERALS (D9.2)
NetU1_L20: FPGA IO (U1.L20), FPGA PERIPHERALS (U6.3)
PROGRAMN: FPGA PERIPHERALS (5 pins), Mechanical and Interconnect (J4.4)
RESET: FPGA IO (U1.G2), FPGA PERIPHERALS (6 pins)
TCK: FPGA PERIPHERALS (5 pins), Mechanical and Interconnect (J4.8)
TDI: FPGA PERIPHERALS (5 pins), Mechanical and Interconnect (J4.3)
TDO: FPGA PERIPHERALS (5 pins), Mechanical and Interconnect (J4.2)
TMS: FPGA PERIPHERALS (5 pins), Mechanical and Interconnect (J4.6)
UDM: DDR3 (U2.D3), DDR3 Termination (R63.1 TP50.1)

## Assembly variants
DAUGHTERBOARD: not fitted C3 C4 C5 C6 C9 C10 C13 C14 C15 C16 C19 C20 C21 C22 C24 C25 C26 C27 C29 C30 C31 C32 C34 C35 C36 C37 C39 C40 C41 C42 C44 C45 C47 C48 C49 C50 C105 C139 C140 C143 C144 C146 C147 C147 C147 C148 C148 C148 C149 CX? R24 R25 R29 R30 R31 R32 R33 R34 R35 R37 R39 R40 R47 R49 R55 R90 R? R? R? R?